# EAGLE schematic driver (EAGLE 8.1.0)
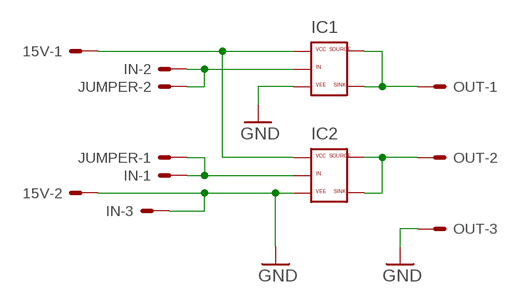
[diagram p0: schematic, sheet 1]

## Parts
15V  22-23-2021  [22-23-2021]
IC1  ZXGD3006E6  [SOT23]
IC2  ZXGD3006E6  [SOT23]
IN  22-23-2031  [22-23-2031]
JUMPER  22-23-2021  [22-23-2021]
OUT  22-23-2031  [22-23-2031]

## Nets
15V+: 15V.1 IC1.1(VCC) IC2.1(VCC)
GND: 15V.2 IC1.3(VEE) IC2.3(VEE) IN.3 OUT.3
IN1: IC2.2(IN) IN.1 JUMPER.1
IN2: IC1.2(IN) IN.2 JUMPER.2
N$5: IC1.4(SINK) IC1.6(SOURCE) OUT.1
N$6: IC2.4(SINK) IC2.6(SOURCE) OUT.2

## Library data of the parts
15V JUMPER = con-molex:22-23-2021: .100" (2.54mm) Center Header - 2 Pin; MF: MOLEX; MPN: 22-23-2021; OC_FARNELL: 1462926; OC_NEWARK: 25C3832
IC1 IC2 = felippe:ZXGD3006E6
IN OUT = con-molex:22-23-2031: .100" (2.54mm) Center Header - 3 Pin; MF: MOLEX; MPN: 22-23-2031; OC_FARNELL: 1462950; OC_NEWARK: 30C0862